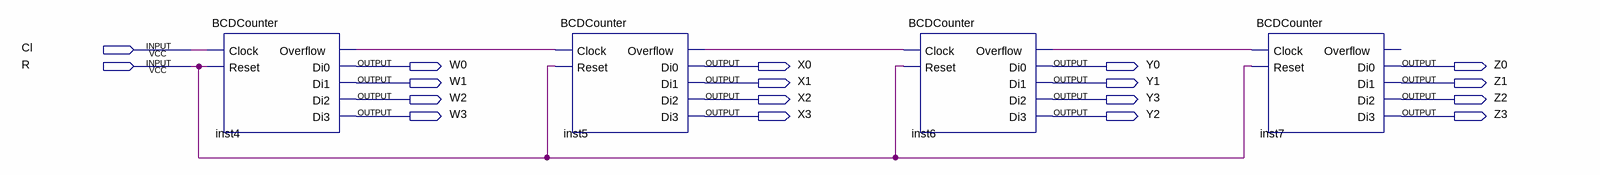
[diagram p0: schematic sheet]
// Quartus schematic BCDinputs.bdf as structural Verilog: 4 symbols, 18 pins
module BCDinputs (
  input  Cl,
  input  R,
  output W0,
  output X0,
  output Y0,
  output Z0,
  output W1,
  output X1,
  output Y1,
  output Z1,
  output W2,
  output X2,
  output Y3,
  output Z2,
  output W3,
  output X3,
  output Y2,
  output Z3
);

  wire inst4_overflow, inst5_overflow, inst6_overflow;

  BCDCounter inst4 (.Clock(Cl), .Reset(R), .Overflow(inst4_overflow), .Di0(W0), .Di1(W1), .Di2(W2), .Di3(W3));
  BCDCounter inst5 (
    .Clock(inst4_overflow), .Reset(R), .Overflow(inst5_overflow), .Di0(X0), .Di1(X1), .Di2(X2), .Di3(X3));
  BCDCounter inst6 (
    .Clock(inst5_overflow), .Reset(R), .Overflow(inst6_overflow), .Di0(Y0), .Di1(Y1), .Di2(Y3), .Di3(Y2));
  BCDCounter inst7 (.Clock(inst6_overflow), .Reset(R), .Di0(Z0), .Di1(Z1), .Di2(Z2), .Di3(Z3));  // open: Overflow
endmodule
